# Altium schematic sheet DSO_RAM.SchDoc: Schematic_Name
size A4; CompanyName: University of Melbourne; Engineer: Your Name Here; DocumentNumber: 1; Revision: 0.1; SheetNumber: 1; SheetTotal: 1; Title_Project: Project_Title; StudentNo: Student No.
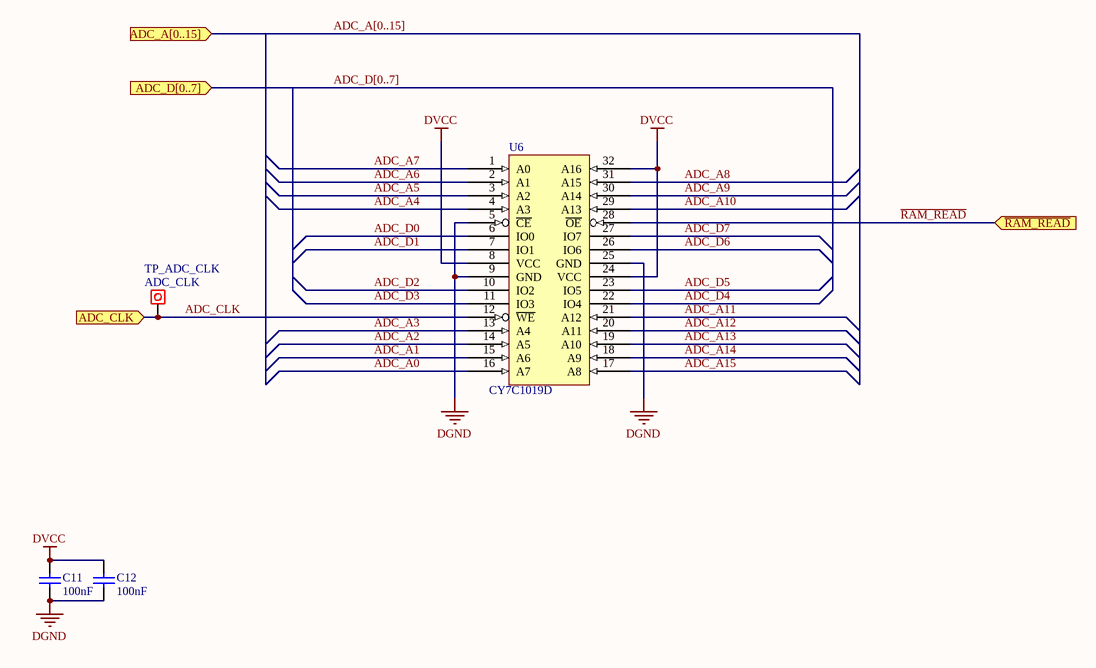
[diagram p0: DSO_RAM.SchDoc]

## Parts
C11  100nF  [0805C]
C12  100nF  [0805C]
TP_ADC_CLK  value ADC_CLK  [Testpoin]  (hidden comment: INPUT)
U6  CY7C1019D  [TSOP-32]

## Ports
ADC_A[0..15] (in), ADC_CLK (in), ADC_D[0..7] (in), ~{RAM_READ} (in)

## Nets
DGND: C11.2 C12.2 U6.5(~{CE}) U6.9(GND) U6.25(GND)
DVCC: C11.1 C12.1 U6.8(VCC) U6.24(VCC) U6.32(A16)
ADC_A0: U6.16(A7)
ADC_A1: U6.15(A6)
ADC_A2: U6.14(A5)
ADC_A3: U6.13(A4)
ADC_A4: U6.4(A3)
ADC_A5: U6.3(A2)
ADC_A6: U6.2(A1)
ADC_A7: U6.1(A0)
ADC_A8: U6.31(A15)
ADC_A9: U6.30(A14)
ADC_A10: U6.29(A13)
ADC_A11: U6.21(A12)
ADC_A12: U6.20(A11)
ADC_A13: U6.19(A10)
ADC_A14: U6.18(A9)
ADC_A15: U6.17(A8)
ADC_CLK: TP_ADC_CLK.1 U6.12(~{WE}) ; port ADC_CLK
ADC_D0: U6.6(IO0)
ADC_D1: U6.7(IO1)
ADC_D2: U6.10(IO2)
ADC_D3: U6.11(IO3)
ADC_D4: U6.22(IO4)
ADC_D5: U6.23(IO5)
ADC_D6: U6.26(IO6)
ADC_D7: U6.27(IO7)
~{RAM_READ}: U6.28(~{OE}) ; port ~{RAM_READ}

## Buses and harness runs
bus ADC_A[0..15] = port ADC_A[0..15]
bus ADC_D[0..7] = port ADC_D[0..7]

## Library data of the parts
C11 C12 = C: Capacitor; Reviewed by: RM - 2018/08/05; Revision: July-2002: Re-released for DXP Platform.; Value: 100nF; Supplier 1: *; Supplier Part Number 1: *
TP_ADC_CLK = Test Point: Pad
U6 = CY7C1019D: SRAM 128k x 8; Reviewed by: RM - 2018/08/05; Supplier 1: Digi-Key; Supplier Part Number 1: 428-1967-ND